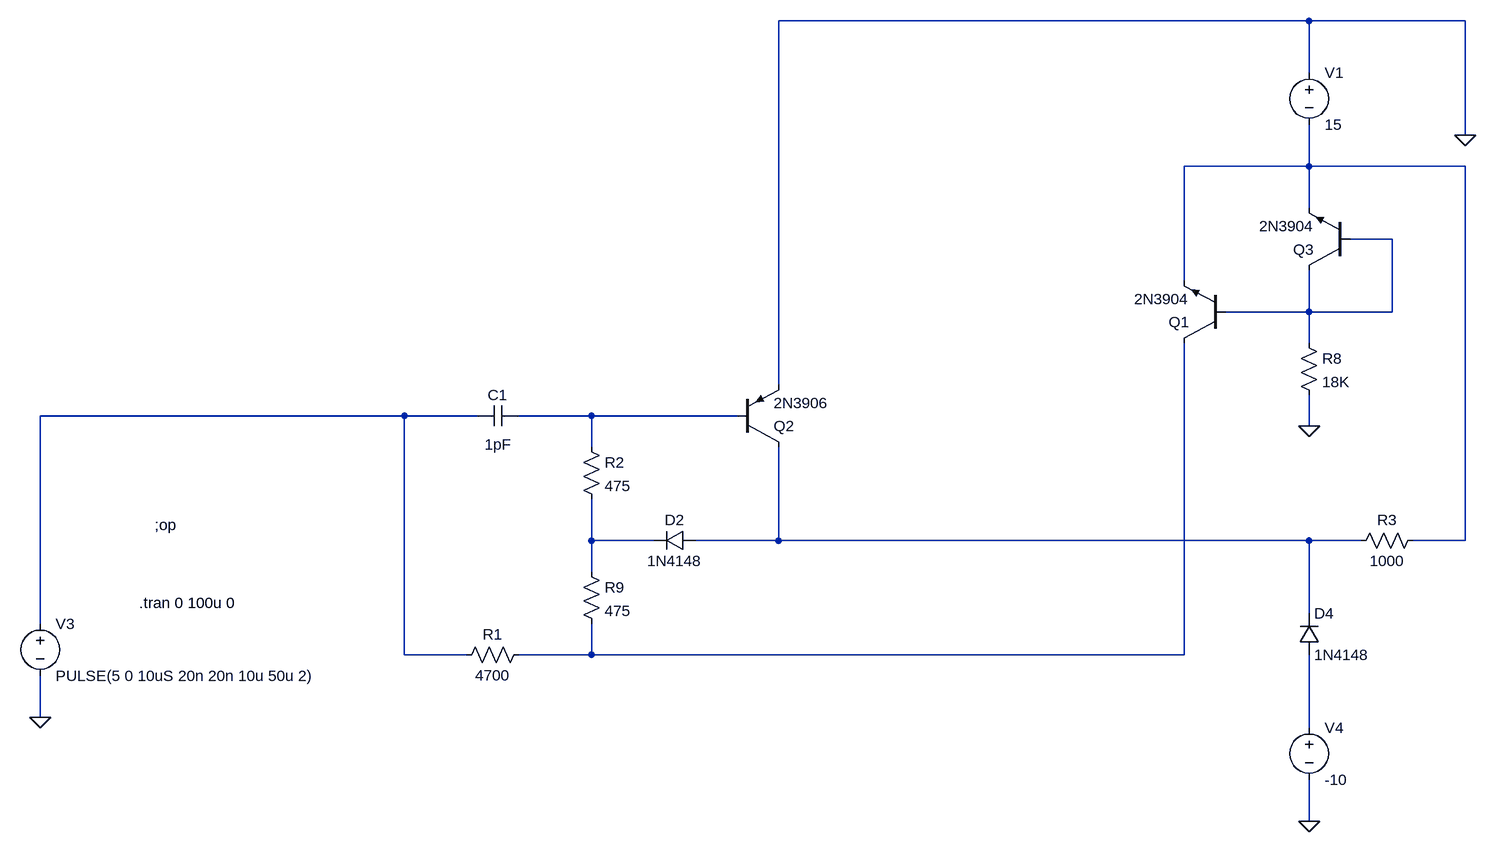
[diagram p0: schematic speed_up2.asc]
speed_up2.asc, the LTspice schematic file:
Version 4
SHEET 1 1588 680
WIRE 1088 -784 272 -784
WIRE 1328 -784 1088 -784
WIRE 1088 -704 1088 -784
WIRE 1328 -608 1328 -784
WIRE 1088 -560 1088 -624
WIRE 1088 -560 896 -560
WIRE 1328 -560 1088 -560
WIRE 1088 -496 1088 -560
WIRE 1216 -448 1152 -448
WIRE 896 -384 896 -560
WIRE 1088 -336 1088 -400
WIRE 1088 -336 960 -336
WIRE 1216 -336 1216 -448
WIRE 1216 -336 1088 -336
WIRE 1088 -288 1088 -336
WIRE 272 -224 272 -784
WIRE -304 -176 -864 -176
WIRE -192 -176 -304 -176
WIRE -16 -176 -128 -176
WIRE 208 -176 -16 -176
WIRE 1088 -160 1088 -208
WIRE -16 -128 -16 -176
WIRE -16 16 -16 -48
WIRE 80 16 -16 16
WIRE 272 16 272 -128
WIRE 272 16 144 16
WIRE 1088 16 272 16
WIRE 1168 16 1088 16
WIRE 1328 16 1328 -560
WIRE 1328 16 1248 16
WIRE -16 64 -16 16
WIRE 1088 128 1088 16
WIRE -864 144 -864 -176
WIRE -304 192 -304 -176
WIRE -208 192 -304 192
WIRE -16 192 -16 144
WIRE -16 192 -128 192
WIRE 896 192 896 -288
WIRE 896 192 -16 192
WIRE -864 288 -864 224
WIRE 1088 304 1088 192
WIRE 1088 448 1088 384
FLAG -864 288 0
FLAG 1088 -160 0
FLAG 1328 -608 0
FLAG 1088 448 0
DATAFLAG 464 192 ""
SYMBOL cap -128 -192 R90
WINDOW 0 0 32 VBottom 2
WINDOW 3 45 31 VTop 2
SYMATTR InstName C1
SYMATTR Value 1pF
SYMBOL pnp 208 -128 M180
SYMATTR InstName Q2
SYMATTR Value 2N3906
SYMBOL voltage 1088 -720 R0
WINDOW 123 0 0 Left 2
WINDOW 39 0 0 Left 2
SYMATTR InstName V1
SYMATTR Value 15
SYMBOL voltage -864 128 R0
WINDOW 123 0 0 Left 2
WINDOW 39 0 0 Left 2
SYMATTR InstName V3
SYMATTR Value PULSE(5 0 10uS 20n 20n 10u 50u 2)
SYMBOL res 1072 -304 R0
SYMATTR InstName R8
SYMATTR Value 18K
SYMBOL res -112 176 R90
WINDOW 0 0 56 VBottom 2
WINDOW 3 32 56 VTop 2
SYMATTR InstName R1
SYMATTR Value 4700
SYMBOL res -32 -144 R0
SYMATTR InstName R2
SYMATTR Value 475
SYMBOL res -32 48 R0
SYMATTR InstName R9
SYMATTR Value 475
SYMBOL diode 144 32 M270
WINDOW 0 32 32 VTop 2
WINDOW 3 0 32 VBottom 2
SYMATTR InstName D2
SYMATTR Value 1N4148
SYMBOL diode 1072 192 M180
WINDOW 0 24 64 Left 2
WINDOW 3 24 0 Left 2
SYMATTR InstName D4
SYMATTR Value 1N4148
SYMBOL voltage 1088 288 R0
WINDOW 123 0 0 Left 2
WINDOW 39 0 0 Left 2
SYMATTR InstName V4
SYMATTR Value -10
SYMBOL npn 960 -288 R180
SYMATTR InstName Q1
SYMATTR Value 2N3904
SYMBOL npn 1152 -400 R180
SYMATTR InstName Q3
SYMATTR Value 2N3904
SYMBOL res 1264 0 R90
WINDOW 0 0 56 VBottom 2
WINDOW 3 32 56 VTop 2
SYMATTR InstName R3
SYMATTR Value 1000
TEXT -688 -8 Left 2 !;op
TEXT -712 112 Left 2 !.tran 0 100u 0

The netlist it stands for:
* speed_up2.asc
C1 N004 N003 1pF
Q2 N006 N004 0 0 2N3906
V1 0 N001 15
V3 N003 0 PULSE(5 0 10uS 20n 20n 10u 50u 2)
R8 N002 0 18K
R1 N007 N003 4700
R2 N004 N005 475
R9 N005 N007 475
D2 N006 N005 1N4148
D4 N008 N006 1N4148
V4 N008 0 -10
Q1 N007 N002 N001 0 2N3904
Q3 N002 N002 N001 0 2N3904
R3 N001 N006 1000
.model D D
.lib standard.dio
.model NPN NPN
.model PNP PNP
.lib standard.bjt
;op
.tran 0 100u 0
.backanno
.end